# Altium schematic sheet CurrentSense.SchDoc
size B; SheetNumber: 6; SheetTotal: 15
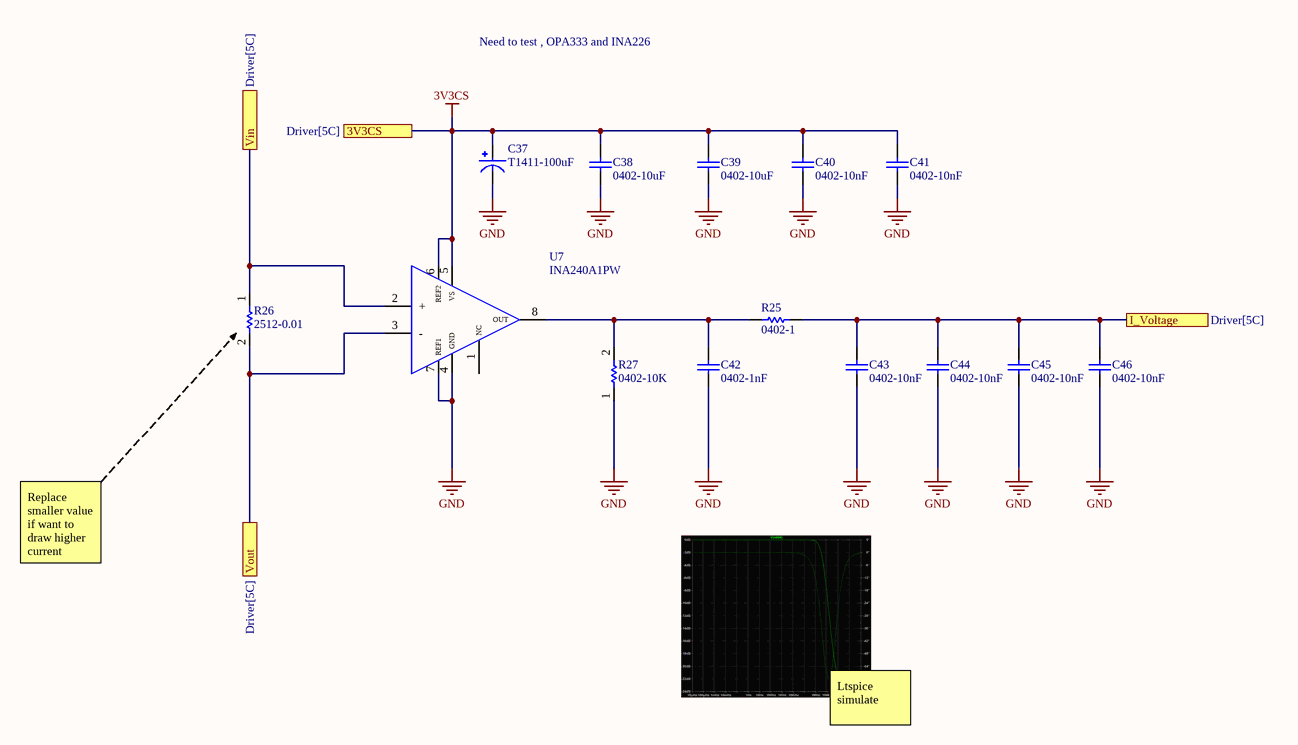
[diagram p0: CurrentSense.SchDoc]

## Parts
C37  T1411-100uF  [CAPPC3528X210N]
C38  0402-10uF  [CAPC0402(1005)60_N]
C39  0402-10uF  [CAPC0402(1005)60_N]
C40  0402-10nF  [CAPC0402(1005)60_N]
C41  0402-10nF  [CAPC0402(1005)60_N]
C42  0402-1nF  [CAPC0402(1005)60_N]
C43  0402-10nF  [CAPC0402(1005)60_N]
C44  0402-10nF  [CAPC0402(1005)60_N]
C45  0402-10nF  [CAPC0402(1005)60_N]
C46  0402-10nF  [CAPC0402(1005)60_N]
R25  0402-1  [R-0402-1K]
R26  2512-0.01  [FP-WSLP2512R0100FEA-IPC_A]
R27  0402-10K  [R-0402-10K]
U7  INA240A1PW  [SOP65P640X120-8N]

## Ports
3V3CS (see Driver[5C]), I_Voltage (see Driver[5C]), Vin (see Driver[5C]), Vout (see Driver[5C])

## Nets
3V3CS: C37.1 C38.2 C39.2 C40.2 C41.2 U7.5(VS) U7.6(REF2) ; port 3V3CS
GND: C37.2 C38.1 C39.1 C40.1 C41.1 C42.1 C43.1 C44.1 C45.1 C46.1 R27.1 U7.4(GND) U7.7(REF1)
I_Voltage: C43.2 C44.2 C45.2 C46.2 R25.2 ; port I_Voltage
Vin: R26.1 U7.2(+) ; port Vin
Vout: R26.2 U7.3(-) ; port Vout
NetC42_2: C42.2 R25.1 R27.2 U7.8(OUT)

Not connected (* = marked no-connect by the designer): U7 1(NC)

## Notes on the sheet
- Need to test , OPA333 and INA226
- Replace smaller value if want to draw higher current
- Ltspice simulate

## Library data of the parts
C37 = CMP-001-00373-1: 100µF Molded Tantalum Polymer Capacitor 25 V 1411 (3528 Metric), 1210 150mOhm @ 100kHz; MF: AVX; MP: TCJB106M025R0150; Check_prices: https://www.snapeda.com/parts/TCJB106M025R0150/AVX/view-part/?ref=eda; Component Type: Standard; Value: 100µF; SnapEDA_Link: https://www.snapeda.com/parts/TCJB106M025R0150/AVX/view-part/?ref=snap; Pins: 2; Case/Package: 1210 AVX; Design Item ID: TCJB106M025R0150; Source: TCJB106M025R0150.SchLib
C38 C39 = CMP-001-00352-3: Capacitor 10uF 0402s; Tolerance: 20%; Value: 10µF; Dielectric: X5R; Voltage Rating (DC): 4V; Width: 0.02inch; Packaging: Tape and Reel; RoHS Compliant: Yes; Series: M; Mount: Surface Mount; Termination: SMD/SMT; Source: 0402-10uF.SchLib; Design Item ID: CMP-1034-02139-2; Min Operating Temperature: -55°C; Construction: Flat; Component Type: Standard; Case Code (Metric): 1005; Length: 0.039inch; Height: 0.5mm; Pins: 2; Thickness: 0.028inch; Voltage Rating: 4V; Package Quantity: 1; Max Operating Temperature: 85°C; Halogen Free: Halogen Free; Case/Package: 0402
C40 C41 C43-C46 = CMP-001-00355-4: Capacitor 10nF 0402; Tolerance: 20%; Dielectric: X5R; Voltage Rating (DC): 4V; Height: 0.5mm; Mount: Surface Mount; Min Operating Temperature: -55°C; Max Operating Temperature: 85°C; RoHS Compliant: Yes; Source: 0402-10uF.SchLib; Width: 0.02inch; Pins: 2; Value: 10nF; Case/Package: 0402; Halogen Free: Halogen Free; Case Code (Metric): 1005; Construction: Flat; Termination: SMD/SMT; Design Item ID: CMP-1034-02139-2; Component Type: Standard; Thickness: 0.028inch; Packaging: Tape and Reel; Series: M; Package Quantity: 1; Length: 0.039inch; Voltage Rating: 4V
C42 = CMP-001-00357-4: Capacitor 1nF 0402; Tolerance: 20%; Dielectric: X5R; Voltage Rating: 4V; Value: 1nF; Min Operating Temperature: -55°C; Component Type: Standard; Termination: SMD/SMT; Height: 0.5mm; Construction: Flat; RoHS Compliant: Yes; Voltage Rating (DC): 4V; Mount: Surface Mount; Case Code (Metric): 1005; Pins: 2; Package Quantity: 1; Max Operating Temperature: 85°C; Length: 0.039inch; Source: 0402-10uF.SchLib; Design Item ID: CMP-1034-02139-2; Case/Package: 0402; Series: M; Packaging: Tape and Reel; Halogen Free: Halogen Free; Thickness: 0.028inch; Width: 0.02inch
R25 = CMP-009-00698-1: 0402Resistor 1Ohm; Value: 1
R26 = CMP-009-00697-1: RES 0.01 OHM 1% 3W 2512; Value: 10m; Temperature Coefficient: 75ppm/°C; Height: 0.635mm; Resistance Tolerance: 1%; Case/Package: 2512; Packaging: Tape and Reel; Length: 6.4mm; Termination: SMD/SMT; Design Item ID: CMP-02407-010954-1; Pins: 2; Max Operating Temperature: 170°C; RoHS Compliant: Yes; Weight: 0.001429oz; Source: 2512.SchLib; Case Code (Metric): 6432; Package Quantity: 2000; Power Rating: 3W; Component Type: Standard; Resistor Type: Metal Strip; Series: WSLP; Min Operating Temperature: -65°C; Lead Free: Lead Free; Tolerance: 1%; Width: 3.2mm
R27 = CMP-009-00675-4: RES 0402 10K; Value: 10k
U7 = CMP-014-00085-3: -4 to 80V, bidirectional, ultra-precise current sense amplifier with enhanced PWM rejection; MF: Texas Instruments; SnapEDA_Link: https://www.snapeda.com/parts/INA240A1PW/Texas+Instruments/view-part/?ref=snap; Value: *; Case/Package: TSSOP-8 Texas Instruments; Design Item ID: INA240A1PW; Pins: 8; Check_prices: https://www.snapeda.com/parts/INA240A1PW/Texas+Instruments/view-part/?ref=eda; MP: INA240A1PW; Source: INA240A1PW.SchLib; Component Type: Standard